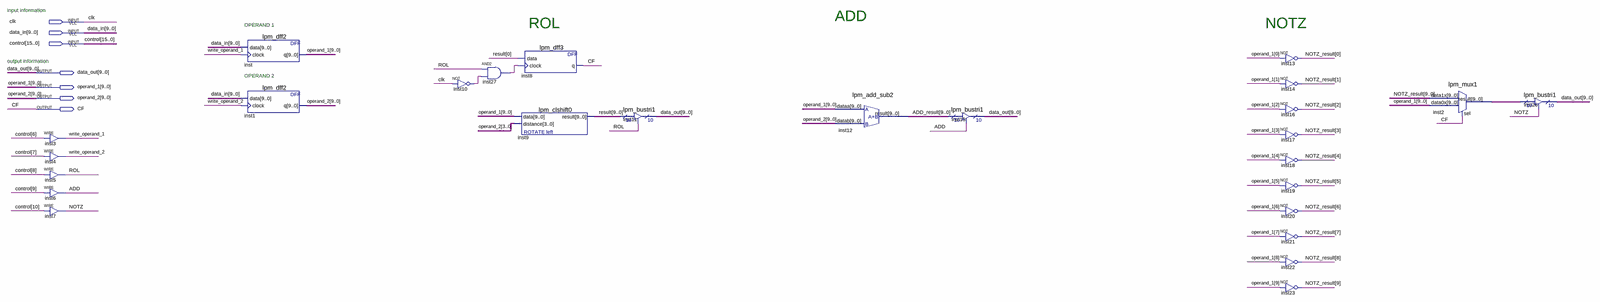
[diagram p0: schematic sheet, whole]
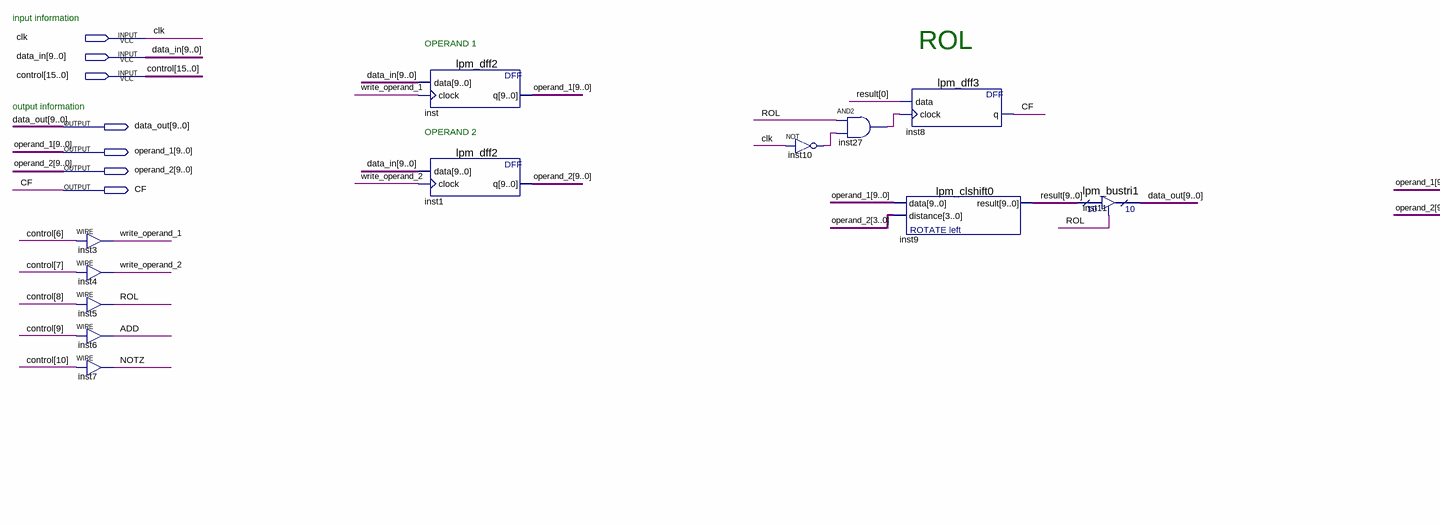
[diagram p1: schematic sheet, left part]
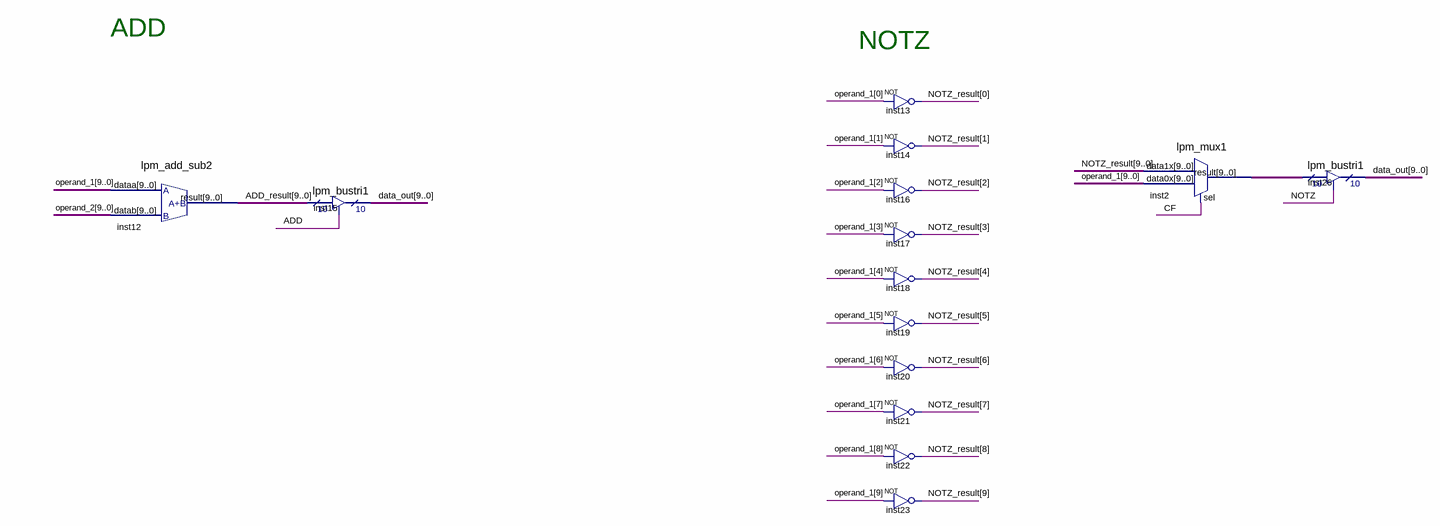
[diagram p2: schematic sheet, right part]
// Quartus schematic ALU.bdf as structural Verilog: 26 symbols, 7 pins
module ALU (
  input  clk,
  input  [9:0] data_in,
  input  [15:0] control,
  output [9:0] data_out,
  output [9:0] operand_1,
  output [9:0] operand_2,
  output CF
);

  wire ADD, inst10_out, inst27_out, NOTZ, ROL, write_operand_1, write_operand_2;
  wire [9:0] ADD_result, inst2_result, NOTZ_result, result;

  assign write_operand_1 = control[6];  // WIRE inst3
  assign write_operand_2 = control[7];  // WIRE inst4
  assign ROL = control[8];  // WIRE inst5
  assign ADD = control[9];  // WIRE inst6
  assign NOTZ = control[10];  // WIRE inst7
  lpm_dff2 inst (.data(data_in), .clock(write_operand_1), .q(operand_1));
  lpm_dff2 inst1 (.data(data_in), .clock(write_operand_2), .q(operand_2));
  not inst10 (inst10_out, clk);
  and inst27 (inst27_out, ROL, inst10_out);
  lpm_dff3 inst8 (.data(result[0]), .clock(inst27_out), .q(CF));
  lpm_clshift0 inst9 (.data(operand_1), .distance(operand_2[3:0]), .result(result));
  lpm_bustri1 inst11 (.enabledt(ROL), .data(result), .tridata(data_out));
  lpm_add_sub2 inst12 (.dataa(operand_1), .datab(operand_2), .result(ADD_result));
  lpm_bustri1 inst15 (.enabledt(ADD), .data(ADD_result), .tridata(data_out));
  not inst13 (NOTZ_result[0], operand_1[0]);
  not inst14 (NOTZ_result[1], operand_1[1]);
  not inst16 (NOTZ_result[2], operand_1[2]);
  not inst17 (NOTZ_result[3], operand_1[3]);
  not inst18 (NOTZ_result[4], operand_1[4]);
  not inst19 (NOTZ_result[5], operand_1[5]);
  not inst20 (NOTZ_result[6], operand_1[6]);
  not inst21 (NOTZ_result[7], operand_1[7]);
  not inst22 (NOTZ_result[8], operand_1[8]);
  not inst23 (NOTZ_result[9], operand_1[9]);
  lpm_mux1 inst2 (.data1x(NOTZ_result), .data0x(operand_1), .sel(CF), .result(inst2_result));
  lpm_bustri1 inst26 (.enabledt(NOTZ), .data(inst2_result), .tridata(data_out));

  // Notes on the sheet:
  //   input information
  //   ADD
  //   ROL
  //   NOTZ
  //   OPERAND 1
  //   output information
  //   OPERAND 2
endmodule
